# Altium schematic sheet 24Vto12V.SchDoc
size A3; SheetNumber: 2; SheetTotal: 4
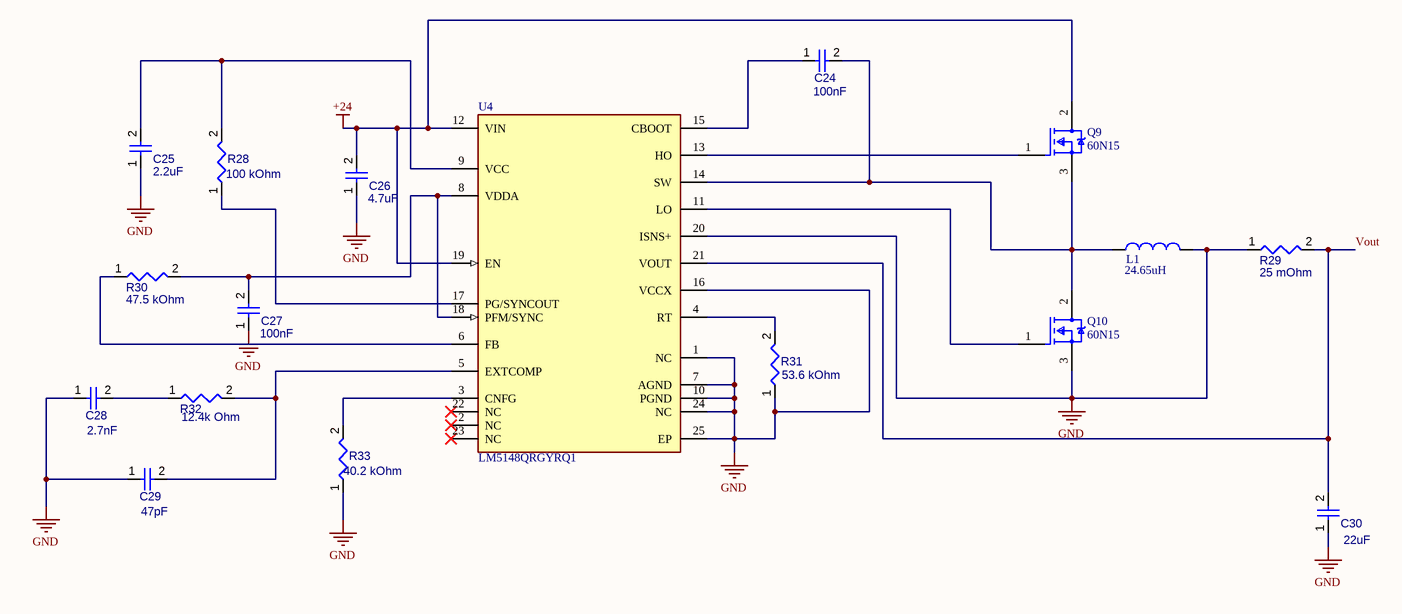
[diagram p0: 24Vto12V.SchDoc]

## Parts
C24  100nF
C25  2.2uF
C26  4.7uF
C27  100nF
C28  2.7nF
C29  47pF
C30  22uF
L1  24.65uH
Q9  60N15  [FP-TO-220AB-MFG]
Q10  60N15  [FP-TO-220AB-MFG]
R28  100 kOhm
R29  25 mOhm
R30  47.5 kOhm
R31  53.6 kOhm
R32  12.4k Ohm
R33  40.2 kOhm
U4  LM5148QRGYRQ1  [FP-RGY0024E-MFG]

## Nets
+24: C26.2 Q9.2(DRAIN) U4.12(VIN) U4.19(EN)
GND: C25.1 C26.1 C27.1 C28.1 C29.1 C30.1 L1.2 Q10.3(SOURCE) R29.1 R31.1 R33.1 U4.1(NC) U4.7(AGND) U4.10(PGND) U4.16(VCCX) U4.20(ISNS+) U4.24(NC) U4.25(EP)
Vout: C30.2 R29.2 U4.21(VOUT)
NetC24_1: C24.1 U4.15(CBOOT)
NetC24_2: C24.2 L1.1 Q9.3(SOURCE) Q10.2(DRAIN) U4.14(SW)
NetC25_2: C25.2 R28.2 U4.9(VCC)
NetC27_2: C27.2 R30.2 U4.8(VDDA) U4.18(PFM/SYNC)
NetC28_2: C28.2 R32.1
NetC29_2: C29.2 R32.2 U4.5(EXTCOMP)
NetQ9_1: Q9.1(GATE) U4.13(HO)
NetQ10_1: Q10.1(GATE) U4.11(LO)
NetR28_1: R28.1 U4.17(PG/SYNCOUT)
NetR30_1: R30.1 U4.6(FB)
NetR31_2: R31.2 U4.4(RT)
NetR33_2: R33.2 U4.3(CNFG)

Not connected (* = marked no-connect by the designer): U4 2(NC)* 22(NC)* 23(NC)*

## Library data of the parts
C24-C30 = Capacitors: Component Type: Capacitors
L1 = Inductors: Component Type: Inductors
Q9 Q10 = CMP-00196-65872431-1: 60N15 150V 60A N-Channel MOSFET TO-220; Number of Elements: 1; Input Capacitance: 2.29nF; Turn-Off Delay Time: 55ns; Drain to Source Breakdown Voltage: 60V; Power Dissipation: 110W; Turn-On Delay Time: 13ns; Max Junction Temperature (Tj): 175°C; Drain to Source Resistance: 7.1mΩ; Continuous Drain Current (ID): 79A; Rds On Max: 8.4mΩ; Gate to Source Voltage (Vgs): 20V; Element Configuration: Single; Length: 10.67mm; Radiation Hardening: No; NexarPartId: 65872431; Case/Package: TO-220AB; Width: 4.83mm; Min Operating Temperature: -55°C; Max Operating Temperature: 175°C; Number of Pins: 3; Drain to Source Voltage (Vdss): 60V; Number of Channels: 1; Height: 9.02mm; Max Power Dissipation: 110W; Mount: Through Hole; RoHS: Compliant
R28-R33 = Resistors: Component Type: Resistors
U4 = CMP-00370-134525155-1: LM5148QRGYRQ1 Automotive, 80-V synchronous buck DC/DC controller with ultra-low IQ 24-VQFN -40 to 125; Manufacturer Lifecycle Status: ACTIVE; Case/Package: VQFN; Number of Pins: 24; Length: 5.5mm; Width: 3.5mm; Thickness: 900µm; NexarPartId: 134525155; Lifecycle Status: Production; Height: 1mm